# Altium project MotorDriver.PrjPCB
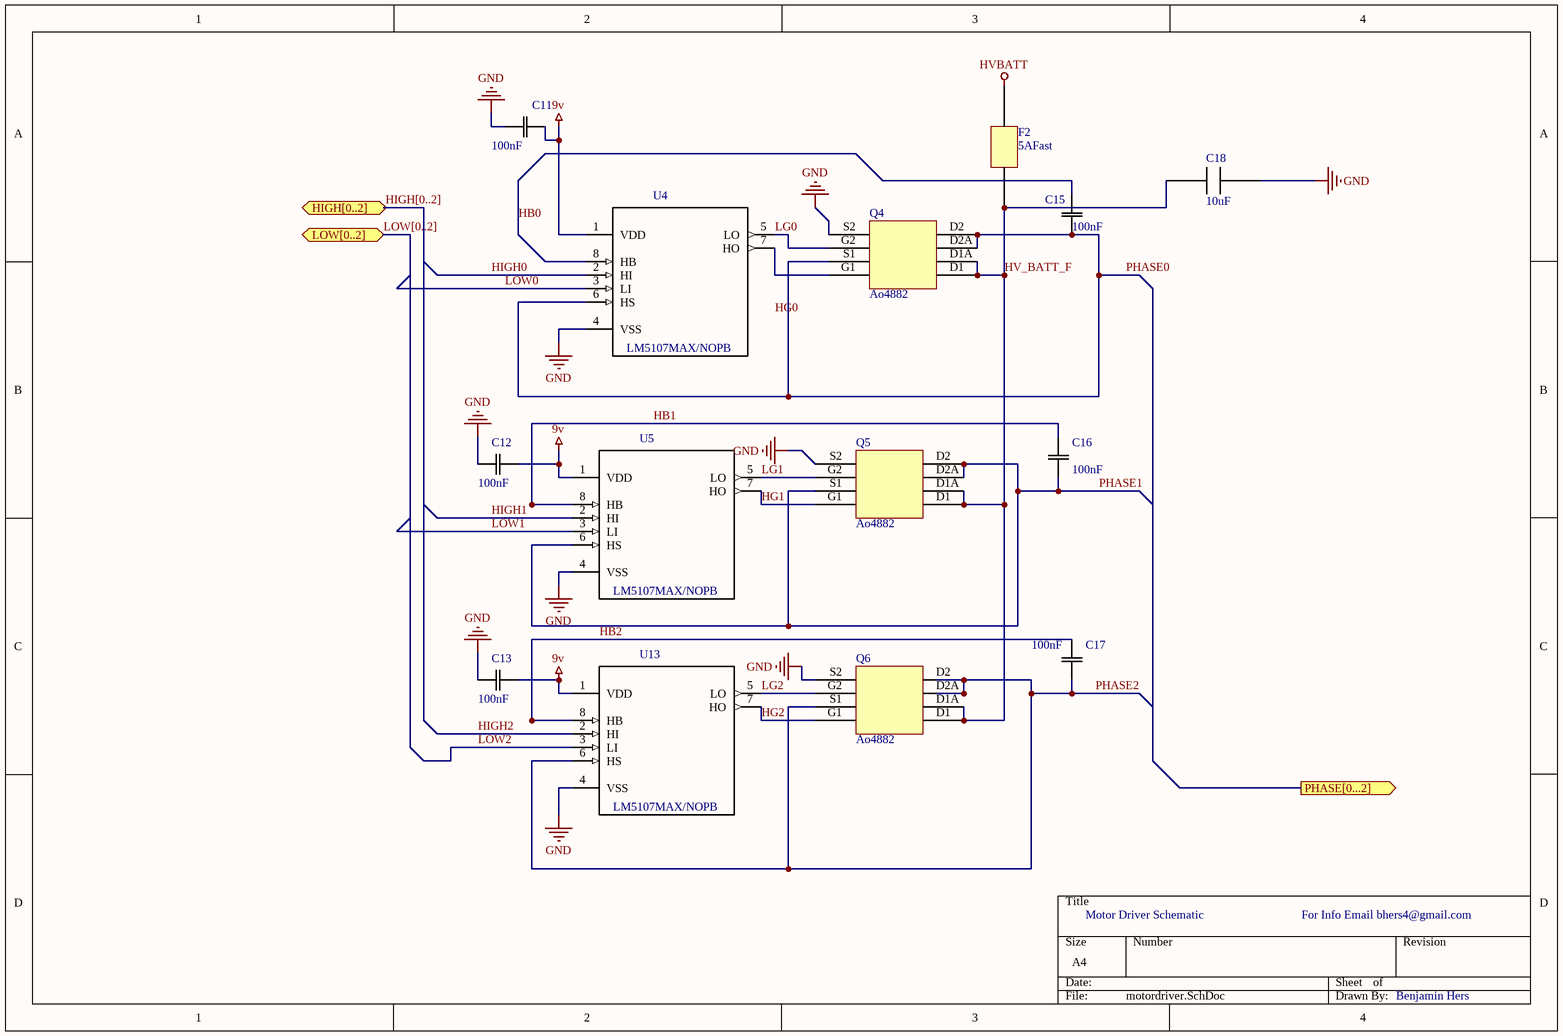
[diagram p0: motordriver.SchDoc]
1 sheet, 14 parts. Net scope: flat (ports and power ports of the same name join across sheets).
Board file: MotorDriverBoard.PcbDoc

## Sheet motordriver.SchDoc
size A4

### Parts
C11  100nF  [CAPC2013X110N]
C12  100nF  [CAPC2013X110N]
C13  100nF  [CAPC2013X110N]
C15  100nF  [CAPC2013X110N]
C16  100nF  [CAPC2013X110N]
C17  100nF  [CAPC2013X110N]
C18  10uF  [CAPC3216X100N]
F2  5AFast  [1206]
Q4  Ao4882  [SOIC127P490X600X175-8N]
Q5  Ao4882  [SOIC127P490X600X175-8N]
Q6  Ao4882  [SOIC127P490X600X175-8N]
U4  LM5107MAX/NOPB  [SOIC127P620X175-8N]
U5  LM5107MAX/NOPB  [SOIC127P620X175-8N]
U13  LM5107MAX/NOPB  [SOIC127P620X175-8N]

### Ports
HIGH[0..2] (in), LOW[0..2] (in), PHASE[0...2] (out)

### Nets
9v: C11.1(C1) C12.2(C2) C13.2(C2) U4.1(VDD) U5.1(VDD) U13.1(VDD)
GND: C11.2(C2) C12.1(C1) C13.1(C1) Q4.S2 Q5.S2 Q6.S2 U4.4(VSS) U5.4(VSS) U13.4(VSS)
HVBATT: F2.Fuseout(Out)
HB0: C15.2(C2) U4.8(HB)
HB1: C16.1(C1) U5.8(HB)
HB2: C17.1(C1) U13.8(HB)
HG1: Q5.G1 U5.7(HO)
HG2: Q6.G1 U13.7(HO)
HIGH0: U4.2(HI)
HIGH1: U5.2(HI)
HIGH2: U13.2(HI)
HV_BATT_F: F2.Fusein(In) Q4.D1 Q4.D1A Q5.D1 Q5.D1A Q6.D1 Q6.D1A
LG0: Q4.G2 U4.5(LO)
LG1: Q5.G2 U5.5(LO)
LG2: Q6.G2 U13.5(LO)
LOW0: U4.3(LI)
LOW1: U5.3(LI)
LOW2: U13.3(LI)
PHASE0: C15.1(C1) Q4.D2 Q4.D2A Q4.S1 U4.6(HS)
PHASE1: C16.2(C2) Q5.D2 Q5.D2A Q5.S1 U5.6(HS)
PHASE2: C17.2(C2) Q6.D2 Q6.D2A Q6.S1 U13.6(HS)
NetQ4_G1: Q4.G1 U4.7(HO)

Not connected (* = marked no-connect by the designer): C18 In Out

### Buses and harness runs
bus HIGH[0..2] = port HIGH[0..2]
bus LOW[0..2] = port LOW[0..2]

### Notes on the sheet
- Motor Driver Schematic
- For Info Email bhers4@gmail.com
- Benjamin Hers
- Labels drawn without touching a wire or pin: HG0

### Library data of the parts
C11-C13 C15-C17 = C0805C104K5RACTU: Capacitor; Ceramic; Cap; .100UF ; Tol+-10%; SMD; Vol-Rtg 50V; X7R, Tape/Reel; MF: Kemet; Package: 0805 Kemet; MP: C0805C104K5RACTU; Value: *
C18 = Component_1
F2 = 5AFast1206
U4 U5 U13 = LM5107MAX/NOPB: MOSFET DRVR 1.4A 2-OUT Hi/Lo Side Full Brdg/Half Brdg Non-Inv 8-Pin SOIC N T/R; MF: Texas Instruments; Digi-Key_Part_Number: LM5107MAX/NOPBCT-ND; MP: LM5107MAX/NOPB; Package: None; Digi-Key_Purchase_URL: https://www.digikey.ca/product-detail/en/texas-instruments/LM5107MAX-NOPB/LM5107MAX-NOPBCT-ND/3527005?WT.z_cid=ref_snapeda; Value: *